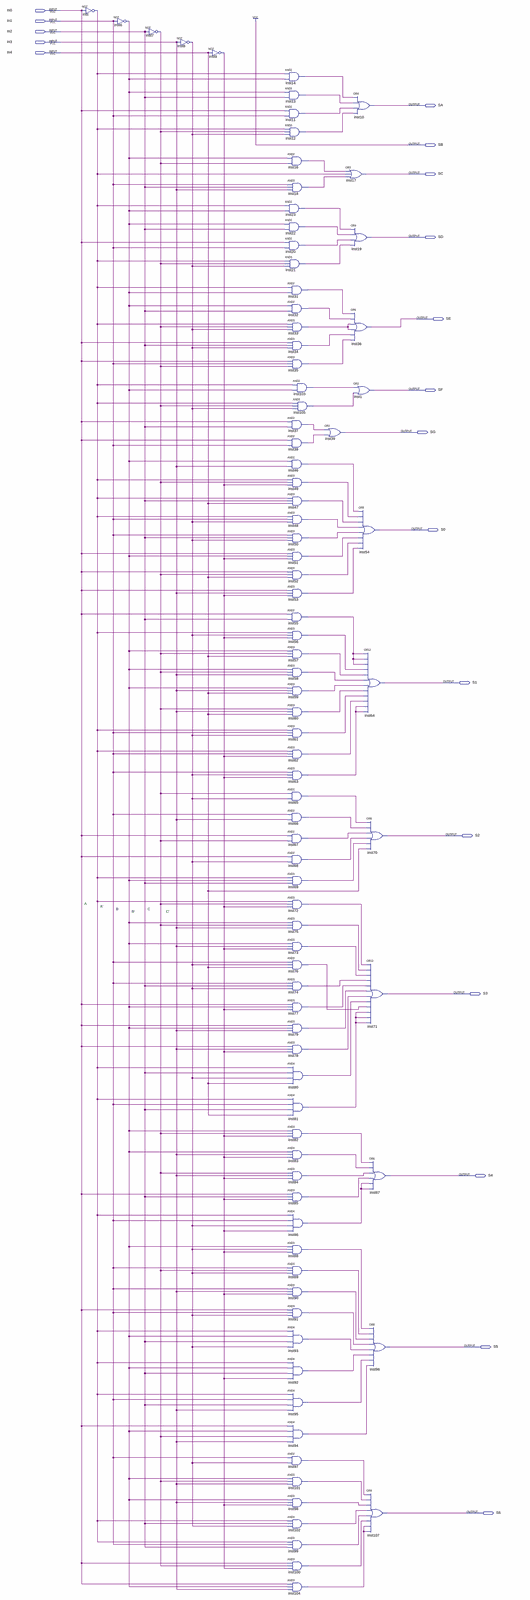
[diagram p0: schematic sheet, whole]
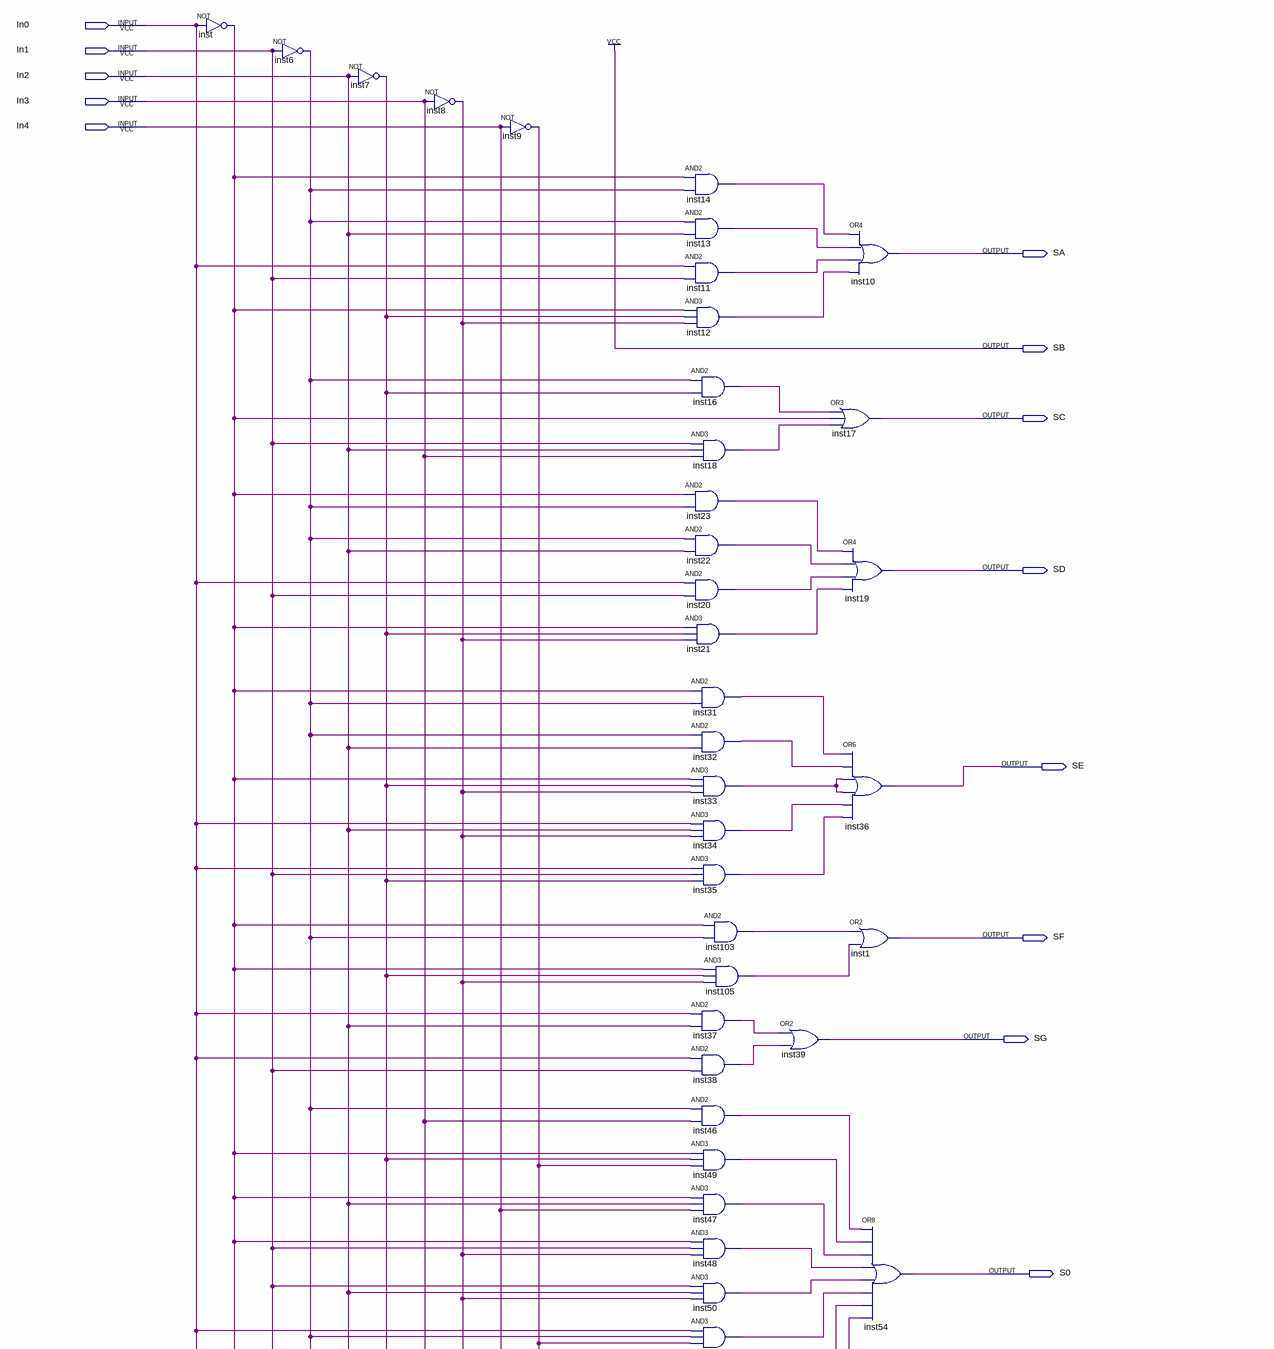
[diagram p1: schematic sheet, upper part]
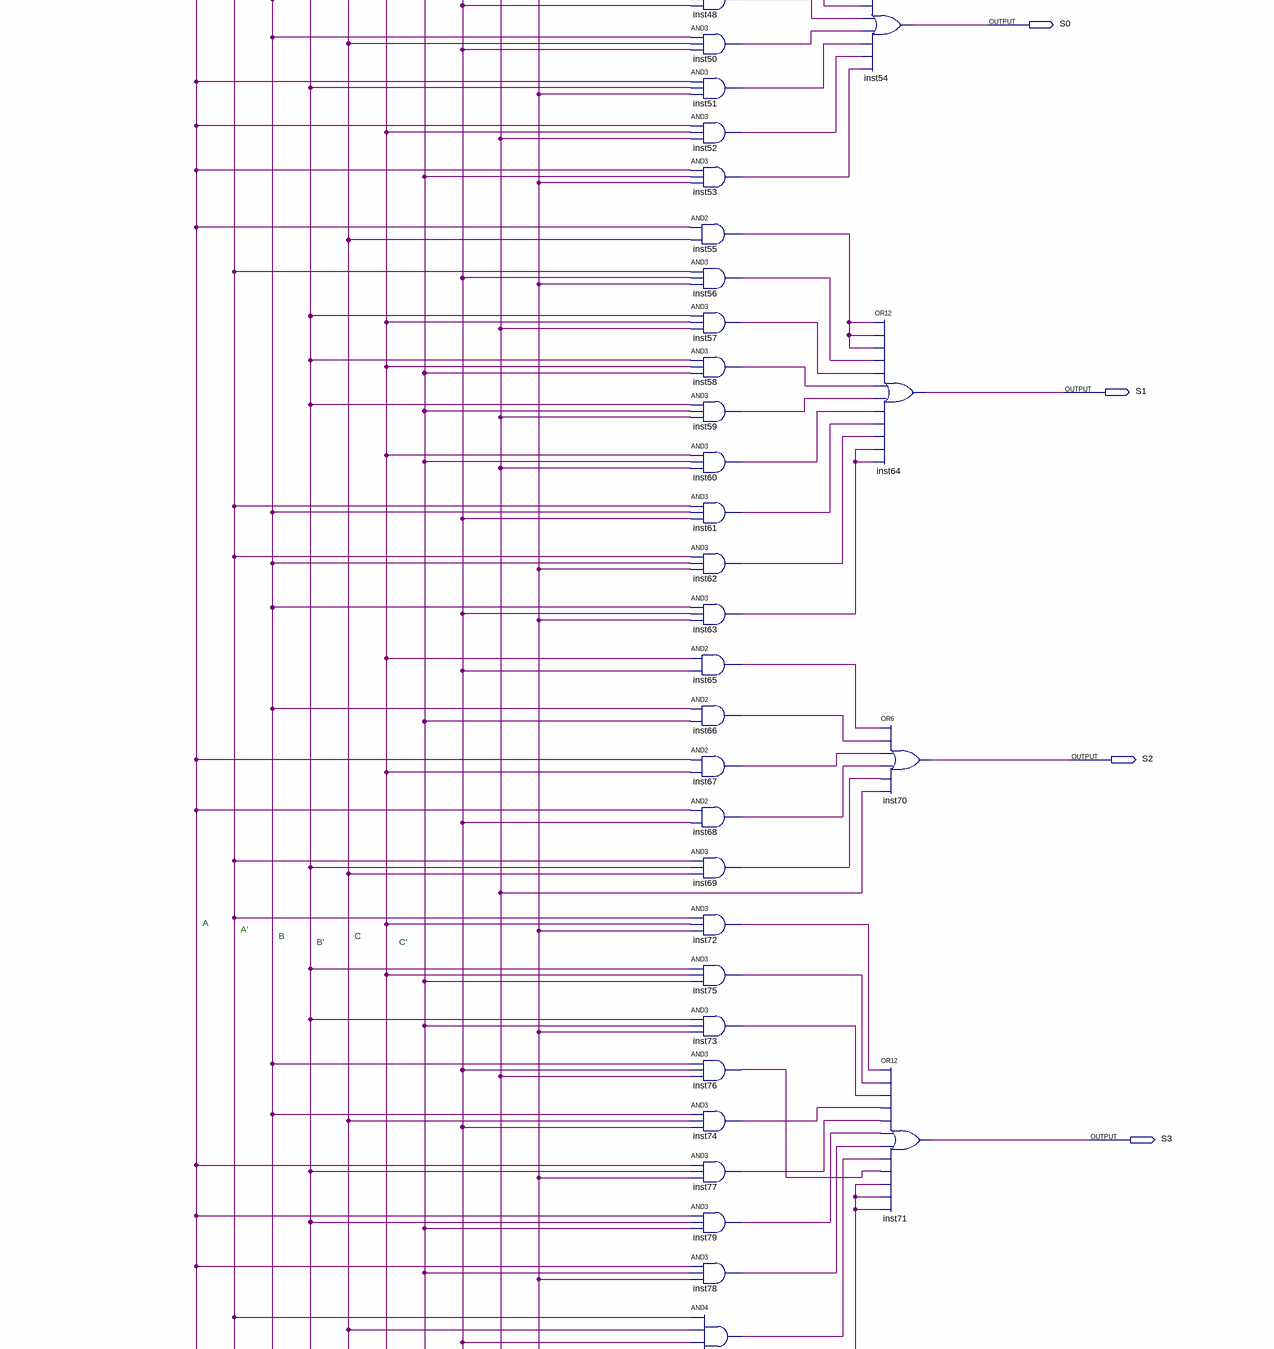
[diagram p2: schematic sheet, middle part]
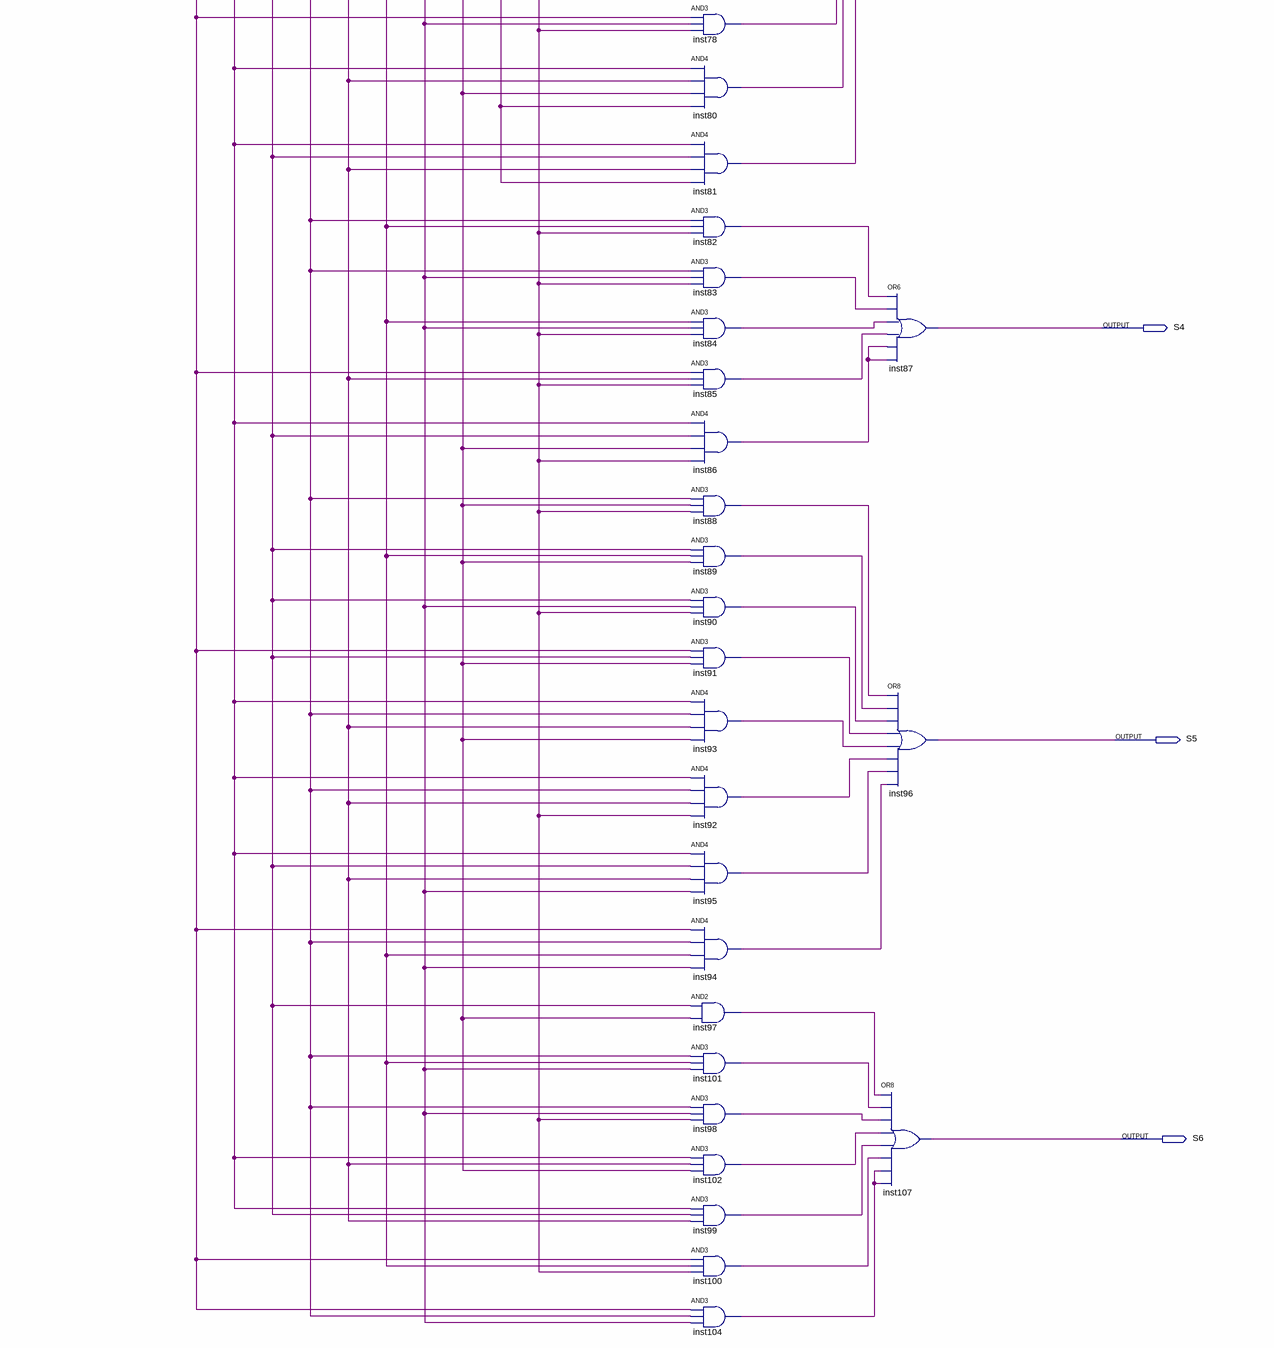
[diagram p3: schematic sheet, lower part]
// Quartus schematic DECODIFICADOR.bdf as structural Verilog: 89 symbols, 19 pins
module DECODIFICADOR (
  input  In0,
  input  In1,
  input  In2,
  input  In3,
  input  In4,
  output SA,
  output SB,
  output SC,
  output SD,
  output SE,
  output SF,
  output SG,
  output S0,
  output S1,
  output S2,
  output S3,
  output S4,
  output S5,
  output S6
);

  wire inst6_out, inst7_out, inst8_out, inst9_out, inst11_out, inst12_out, inst13_out, inst14_out,
       inst16_out, inst18_out, inst20_out, inst21_out, inst22_out, inst23_out, inst31_out, inst32_out,
       inst33_out, inst34_out, inst35_out, inst37_out, inst38_out, inst46_out, inst47_out, inst48_out,
       inst49_out, inst50_out, inst51_out, inst52_out, inst53_out, inst55_out, inst56_out, inst57_out,
       inst58_out, inst59_out, inst60_out, inst61_out, inst62_out, inst63_out, inst65_out, inst66_out,
       inst67_out, inst68_out, inst69_out, inst72_out, inst73_out, inst74_out, inst75_out, inst76_out,
       inst77_out, inst78_out, inst79_out, inst80_out, inst81_out, inst82_out, inst83_out, inst84_out,
       inst85_out, inst86_out, inst88_out, inst89_out, inst90_out, inst91_out, inst92_out, inst93_out,
       inst94_out, inst95_out, inst97_out, inst98_out, inst99_out, inst100_out, inst101_out, inst102_out,
       inst103_out, inst104_out, inst105_out, inst_out;

  not inst (inst_out, In0);
  not inst6 (inst6_out, In1);
  not inst7 (inst7_out, In2);
  not inst8 (inst8_out, In3);
  not inst9 (inst9_out, In4);
  and inst14 (inst14_out, inst_out, inst6_out);
  and inst13 (inst13_out, inst6_out, In2);
  and inst11 (inst11_out, In0, In1);
  and inst12 (inst12_out, inst_out, inst7_out, inst8_out);
  and inst16 (inst16_out, inst6_out, inst7_out);
  and inst18 (inst18_out, In1, In2, In3);
  and inst23 (inst23_out, inst_out, inst6_out);
  and inst22 (inst22_out, inst6_out, In2);
  and inst20 (inst20_out, In0, In1);
  and inst21 (inst21_out, inst_out, inst7_out, inst8_out);
  and inst31 (inst31_out, inst_out, inst6_out);
  and inst32 (inst32_out, inst6_out, In2);
  and inst33 (inst33_out, inst_out, inst7_out, inst8_out);
  and inst34 (inst34_out, In0, In2, inst8_out);
  and inst35 (inst35_out, In0, In1, inst7_out);
  and inst103 (inst103_out, inst_out, inst6_out);
  and inst105 (inst105_out, inst_out, inst7_out, inst8_out);
  and inst37 (inst37_out, In0, In2);
  and inst38 (inst38_out, In0, In1);
  and inst46 (inst46_out, inst6_out, In3);
  and inst49 (inst49_out, inst_out, inst7_out, inst9_out);
  and inst47 (inst47_out, inst_out, In2, In4);
  and inst48 (inst48_out, inst_out, In1, inst8_out);
  and inst50 (inst50_out, In1, In2, inst8_out);
  and inst51 (inst51_out, In0, inst6_out, inst9_out);
  and inst52 (inst52_out, In0, inst7_out, In4);
  and inst53 (inst53_out, In0, In3, inst9_out);
  and inst55 (inst55_out, In0, In2);
  and inst56 (inst56_out, inst_out, inst8_out, inst9_out);
  and inst57 (inst57_out, inst6_out, inst7_out, In4);
  and inst58 (inst58_out, inst6_out, inst7_out, In3);
  and inst59 (inst59_out, inst6_out, In3, In4);
  and inst60 (inst60_out, inst7_out, In3, In4);
  and inst61 (inst61_out, inst_out, In1, inst8_out);
  and inst62 (inst62_out, inst_out, In1, inst9_out);
  and inst63 (inst63_out, In1, inst8_out, inst9_out);
  and inst65 (inst65_out, inst7_out, inst8_out);
  and inst66 (inst66_out, In1, In3);
  and inst67 (inst67_out, In0, inst7_out);
  and inst68 (inst68_out, In0, inst8_out);
  and inst69 (inst69_out, inst_out, inst6_out, In2);
  and inst72 (inst72_out, inst_out, inst7_out, inst9_out);
  and inst75 (inst75_out, inst6_out, inst7_out, In3);
  and inst73 (inst73_out, inst6_out, In3, inst9_out);
  and inst76 (inst76_out, In1, inst8_out, In4);
  and inst74 (inst74_out, In1, In2, inst8_out);
  and inst77 (inst77_out, In0, inst6_out, inst9_out);
  and inst79 (inst79_out, In0, inst6_out, In3);
  and inst78 (inst78_out, In0, In3, inst9_out);
  and inst80 (inst80_out, inst_out, In2, inst8_out, In4);
  and inst81 (inst81_out, inst_out, In1, In2, In4);
  and inst82 (inst82_out, inst6_out, inst7_out, inst9_out);
  and inst83 (inst83_out, inst6_out, In3, inst9_out);
  and inst84 (inst84_out, inst7_out, In3, inst9_out);
  and inst85 (inst85_out, In0, In2, inst9_out);
  and inst86 (inst86_out, inst_out, In1, inst8_out, inst9_out);
  and inst88 (inst88_out, inst6_out, inst8_out, inst9_out);
  and inst89 (inst89_out, In1, inst7_out, inst8_out);
  and inst90 (inst90_out, In1, In3, inst9_out);
  and inst91 (inst91_out, In0, In1, inst8_out);
  and inst93 (inst93_out, inst_out, inst6_out, In2, inst8_out);
  and inst92 (inst92_out, inst_out, inst6_out, In2, inst9_out);
  and inst95 (inst95_out, inst_out, In1, In2, In3);
  and inst94 (inst94_out, In0, inst6_out, inst7_out, In3);
  and inst97 (inst97_out, In1, inst8_out);
  and inst101 (inst101_out, inst6_out, inst7_out, In3);
  and inst98 (inst98_out, inst6_out, In3, inst9_out);
  and inst102 (inst102_out, inst_out, In2, inst8_out);
  and inst99 (inst99_out, inst_out, In1, In2);
  and inst100 (inst100_out, In0, inst7_out, inst9_out);
  and inst104 (inst104_out, In0, inst6_out, In3);
  or inst39 (SG, inst37_out, inst38_out);
  or inst10 (SA, inst14_out, inst13_out, inst11_out, inst12_out);
  or inst17 (SC, inst16_out, inst_out, inst18_out);
  or inst19 (SD, inst23_out, inst22_out, inst20_out, inst21_out);
  or inst36 (SE, inst31_out, inst32_out, inst33_out, inst33_out, inst34_out, inst35_out);
  or inst1 (SF, inst103_out, inst105_out);
  or inst54 (S0, inst46_out, inst49_out, inst47_out, inst48_out, inst50_out, inst51_out, inst52_out, inst53_out);
  or inst64 (S1, inst55_out, inst55_out, inst55_out, inst56_out, inst57_out, inst58_out, inst59_out, inst60_out, inst61_out, inst62_out, inst63_out, inst63_out);
  or inst70 (S2, inst65_out, inst66_out, inst67_out, inst68_out, inst69_out, In4);
  or inst71 (S3, inst72_out, inst75_out, inst73_out, inst74_out, inst77_out, inst79_out, inst78_out, inst80_out, inst76_out, inst81_out, inst81_out, inst81_out);
  or inst87 (S4, inst82_out, inst83_out, inst84_out, inst85_out, inst86_out, inst86_out);
  or inst96 (S5, inst88_out, inst89_out, inst90_out, inst91_out, inst93_out, inst92_out, inst95_out, inst94_out);
  or inst107 (S6, inst97_out, inst101_out, inst98_out, inst102_out, inst99_out, inst100_out, inst104_out, inst104_out);

  assign SB = 1'b1;

  // Notes on the sheet:
  //   A
  //   A'
  //   B
  //   C
  //   B'
  //   C'
endmodule
